# EAGLE design ElectronBoardMKI (EAGLE 9.1.3)
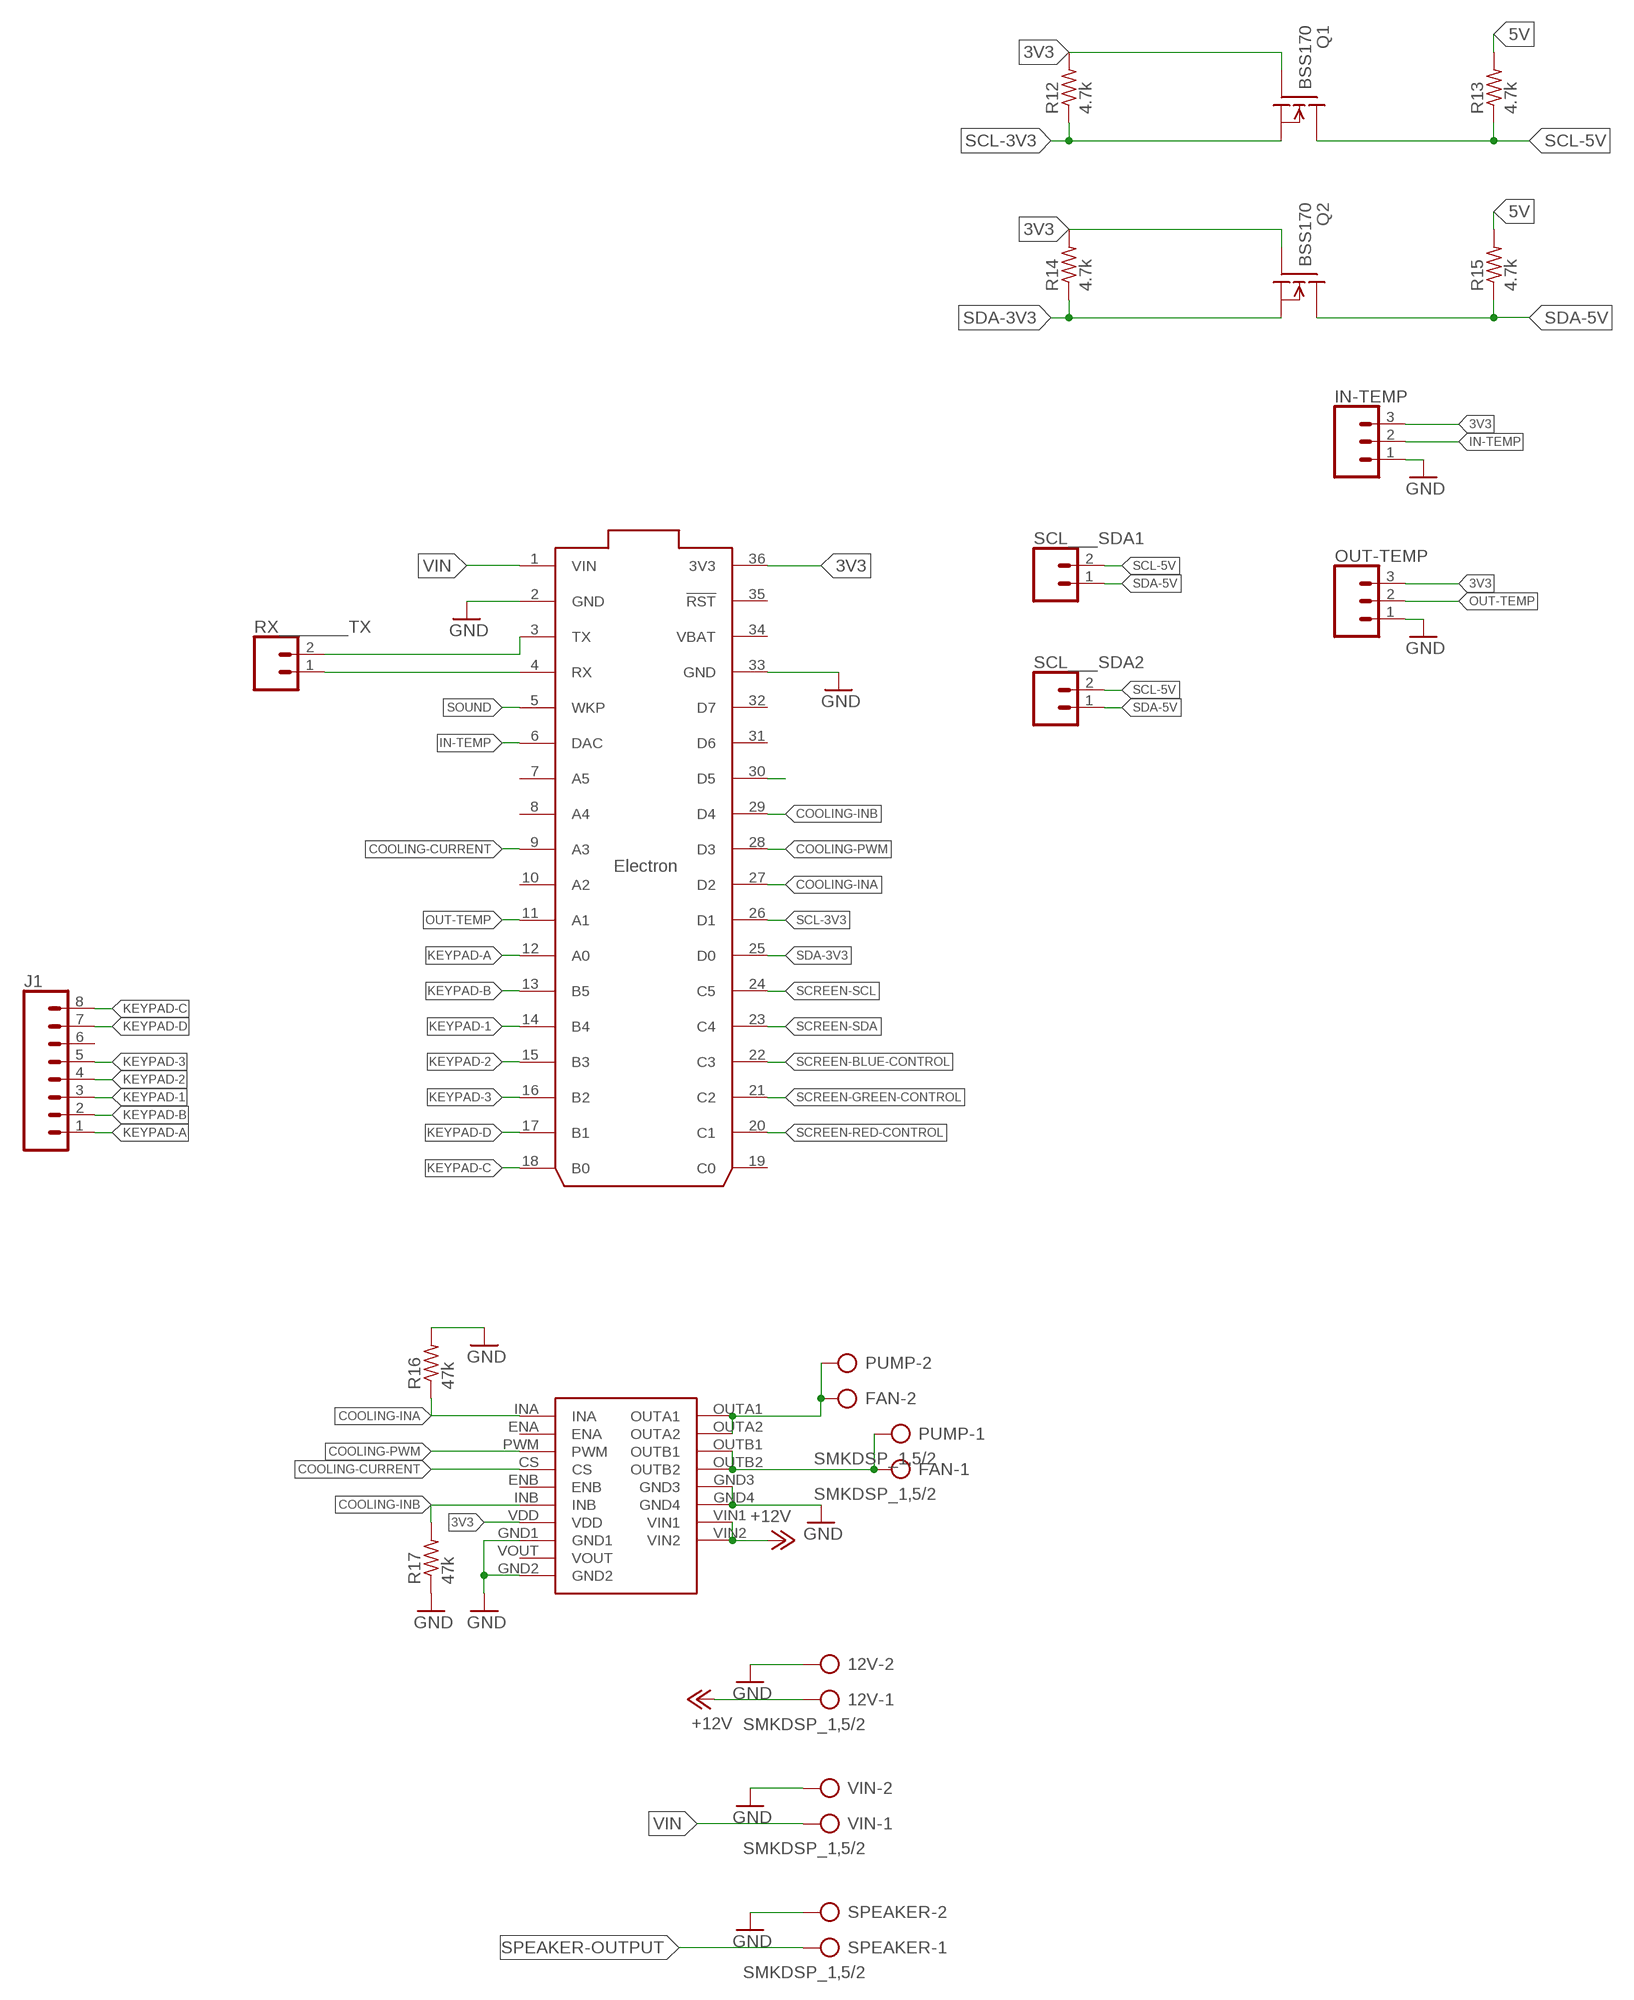
[diagram p0: schematic, sheet 1, part 1 of 2]
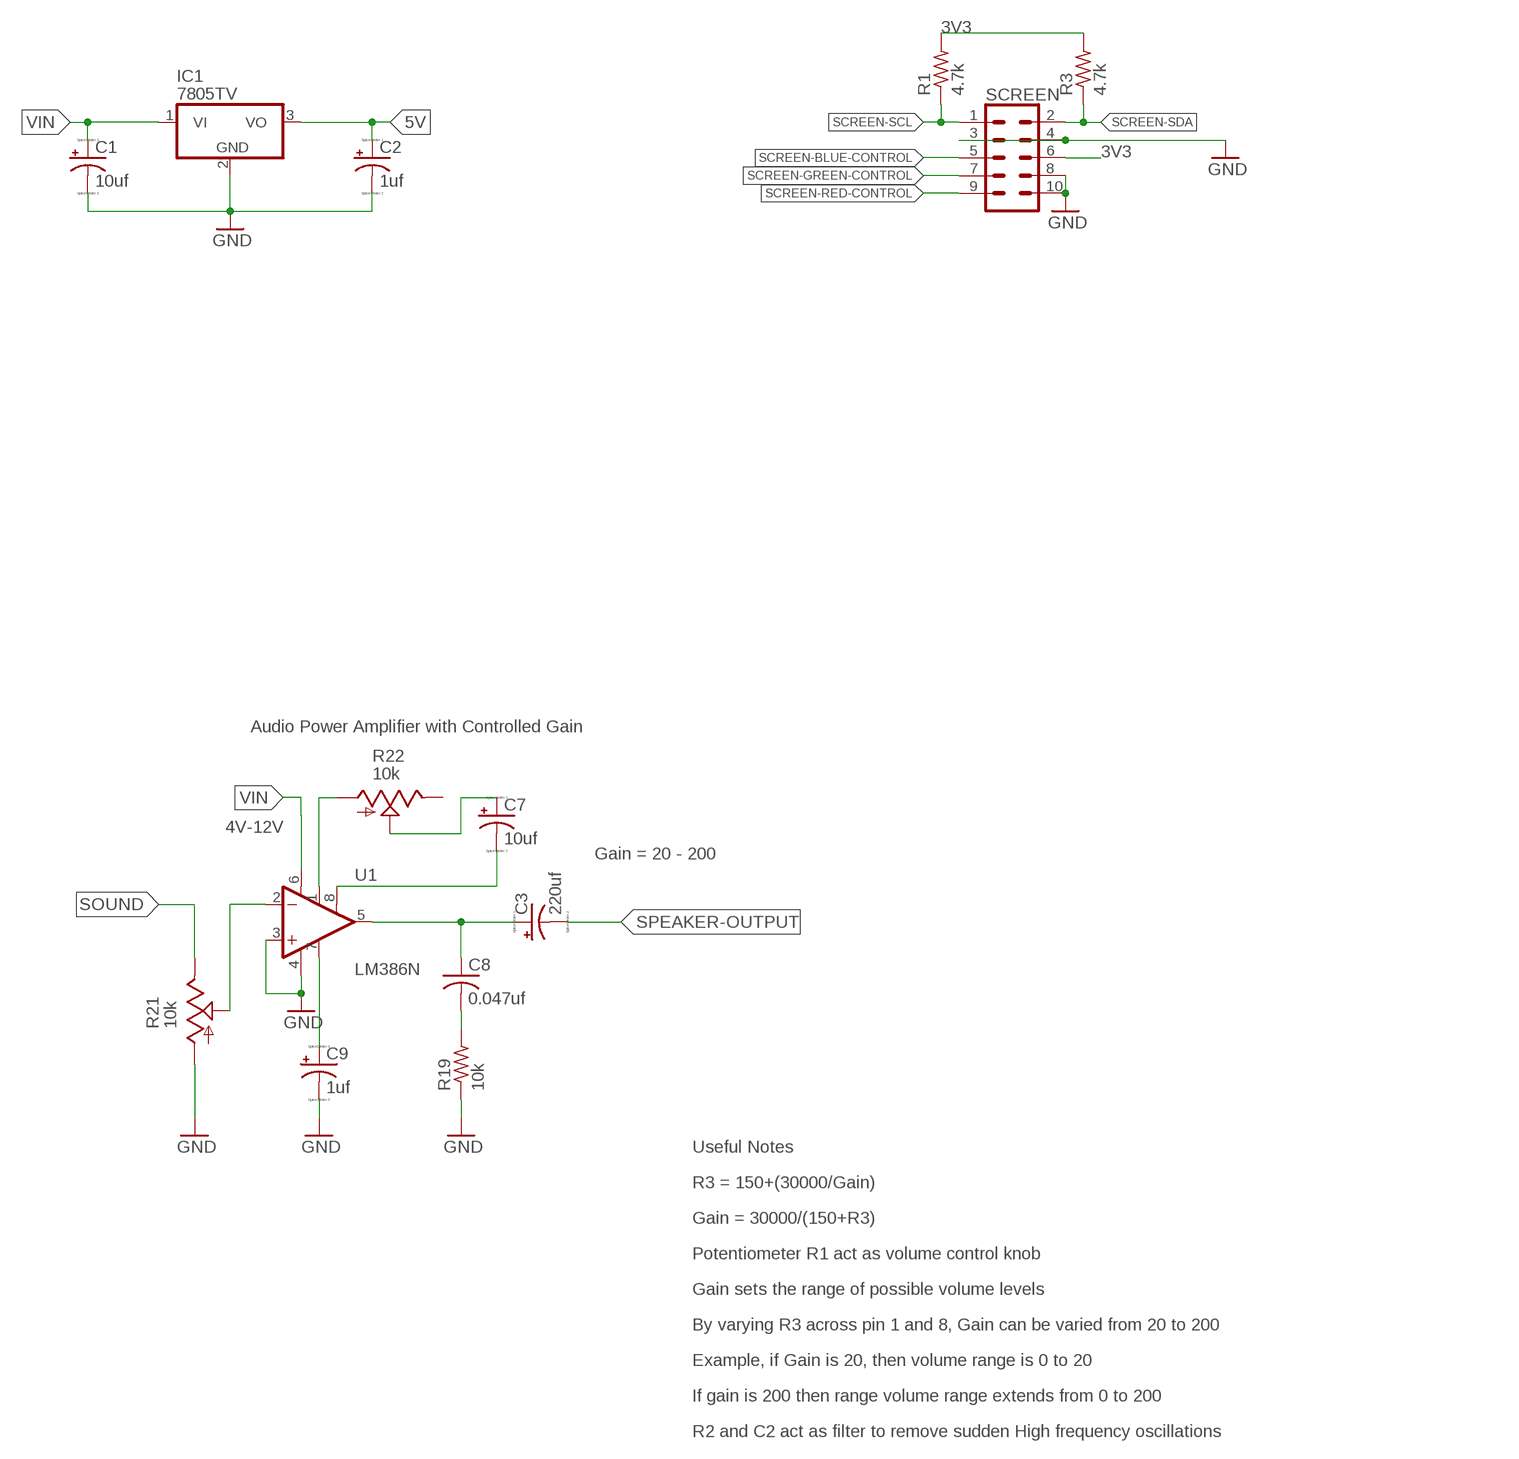
[diagram p1: schematic, sheet 1, part 2 of 2]

## Parts
12V  SMKDSP_1,5/2  [SMKDSP_1,5/2]
C1  10uf  CPOL-USE5-8.5  [E5-8,5]
C2  1uf  CPOL-USE5-8.5  [E5-8,5]
C3  220uf  CPOL-USE5-8.5  [E5-8,5]
C7  10uf  CPOL-USE5-8.5  [E5-8,5]
C8  0.047uf  C-US050-035X075  [C050-035X075]
C9  1uf  CPOL-USE5-8.5  [E5-8,5]
FAN  SMKDSP_1,5/2  [SMKDSP_1,5/2]
IC1  7805TV  [TO220V]
IN-TEMP  CONN_03LOCK_LONGPADS  [1X03_LOCK_LONGPADS]
J1  CONN_08LOCK_LONGPADS  [1X08_LOCK_LONGPADS]
OUT-TEMP  CONN_03LOCK_LONGPADS  [1X03_LOCK_LONGPADS]
PUMP  SMKDSP_1,5/2  [SMKDSP_1,5/2]
Q1  BSS170  BSS101  [TO92]
Q2  BSS170  BSS101  [TO92]
R1  4.7k  R-US_0207/12  [0207/12]
R3  4.7k  R-US_0207/12  [0207/12]
R12  4.7k  R-US_0207/12  [0207/12]
R13  4.7k  R-US_0207/12  [0207/12]
R14  4.7k  R-US_0207/12  [0207/12]
R15  4.7k  R-US_0207/12  [0207/12]
R16  47k  R-US_0207/12  [0207/12]
R17  47k  R-US_0207/12  [0207/12]
R19  10k  R-US_0207/12  [0207/12]
R21  10k  TRIM_US-CT6  [CT6]
R22  10k  TRIM_US-CT6  [CT6]
RX_______TX  CONN_02LOCK_LONGPADS  [1X02_LOCK_LONGPADS]
SCL___SDA1  CONN_02LOCK_LONGPADS  [1X02_LOCK_LONGPADS]
SCL___SDA2  CONN_02LOCK_LONGPADS  [1X02_LOCK_LONGPADS]
SCREEN  CONN_05X2SHD  [2X5-SHROUDED]
SPEAKER  SMKDSP_1,5/2  [SMKDSP_1,5/2]
U1  LM386N  LM386  [DIP08]
U$1  ELECTRON_WITH_HEADERS  [ELECTRON]
U$2  VNH5019VNH5019BOARD  [DIP3302W60P254L2400H500Q20B]
VIN  SMKDSP_1,5/2  [SMKDSP_1,5/2]

## Nets
3V3: IN-TEMP.3 OUT-TEMP.3 Q1.2(G) Q2.2(G) R1.2 R3.2 R12.2 R14.2 SCREEN.6 U$1.36(3V3) U$2.VDD
5V: C2.+ IC1.3(VO) R13.2 R15.2
+12V: 12V.1 U$2.VIN1 U$2.VIN2
COOLING-CURRENT: U$1.9(A3) U$2.CS
COOLING-INA: R16.1 U$1.27(D2) U$2.INA
COOLING-INB: R17.2 U$1.29(D4) U$2.INB
COOLING-OUTA: FAN.2 PUMP.2 U$2.OUTA1 U$2.OUTA2
COOLING-OUTB: FAN.1 PUMP.1 U$2.OUTB1 U$2.OUTB2
COOLING-PWM: U$1.28(D3) U$2.PWM
GND: 12V.2 C1.- C2.- C9.- IC1.2(GND) IN-TEMP.1 OUT-TEMP.1 R16.2 R17.1 R19.1 R21.A SCREEN.3 SCREEN.4 SCREEN.8 SCREEN.10 SPEAKER.2 U1.3(+IN) U1.4(V-) U$1.2(GND) U$1.33(GND) U$2.GND1 U$2.GND2 U$2.GND3 U$2.GND4 VIN.2
IN-TEMP: IN-TEMP.2 U$1.6(DAC)
KEYPAD-1: J1.3 U$1.14(B4)
KEYPAD-2: J1.4 U$1.15(B3)
KEYPAD-3: J1.5 U$1.16(B2)
KEYPAD-A: J1.1 U$1.12(A0)
KEYPAD-B: J1.2 U$1.13(B5)
KEYPAD-C: J1.8 U$1.18(B0)
KEYPAD-D: J1.7 U$1.17(B1)
N$1: R21.S U1.2(-IN)
N$2: C9.+ U1.7(BP)
N$4: R22.A U1.1(GAIN)
N$5: C7.- U1.8(GAIN)
N$6: C3.+ C8.1 U1.5(OUT)
N$7: C8.2 R19.2
N$8: U$1.30(D5)
N$9: C7.+ R22.S
OUT-TEMP: OUT-TEMP.2 U$1.11(A1)
RX: RX_______TX.1 U$1.4(RX)
SCL-3V3: Q1.1(S) R12.1 U$1.26(D1)
SCL-5V: Q1.3(D) R13.1 SCL___SDA1.2 SCL___SDA2.2
SCREEN-BLUE-CONTROL: SCREEN.5 U$1.22(C3)
SCREEN-GREEN-CONTROL: SCREEN.7 U$1.21(C2)
SCREEN-RED-CONTROL: SCREEN.9 U$1.20(C1)
SCREEN-SCL: R1.1 SCREEN.1 U$1.24(C5)
SCREEN-SDA: R3.1 SCREEN.2 U$1.23(C4)
SDA-3V3: Q2.1(S) R14.1 U$1.25(D0)
SDA-5V: Q2.3(D) R15.1 SCL___SDA1.1 SCL___SDA2.1
SOUND: R21.E U$1.5(WKP)
SPEAKER-OUTPUT: C3.- SPEAKER.1
TX: RX_______TX.2 U$1.3(TX)
VIN: C1.+ IC1.1(VI) U1.6(V+) U$1.1(VIN) VIN.1
Unconnected: J1.6 R22.E U$1.7(A5) U$1.8(A4) U$1.10(A2) U$1.19(C0) U$1.31(D6) U$1.32(D7) U$1.35(!RST) U$2.ENA U$2.ENB U$2.VOUT

## Notes on the sheet
- Audio Power Amplifier with Controlled Gain
- 4V-12V
- Gain = 20 - 200
- Useful Notes
- R3 = 150+(30000/Gain)
- Gain = 30000/(150+R3)
- Potentiometer R1 act as volume control knob
- Gain sets the range of possible volume levels
- By varying R3 across pin 1 and 8, Gain can be varied from 20 to 200
- Example, if Gain is 20, then volume range is 0 to 20
- If gain is 200 then range volume range extends from 0 to 200
- R2 and C2 act as filter to remove sudden High frequency oscillations

## Power pins joined to a net without a drawn wire
VBAT: U$1.34(VBAT)

## Library data of the parts
12V FAN PUMP SPEAKER VIN = con-phoenix-smkdsp:SMKDSP_1,5/2: Printklemme, Nennstrom: 17,5 A, Bemessungsspannung: 250 V, Raster: 5,0 mm Source: http://eshop.phoenixcontact.de .. 1733415.pdf; MF: FARNELL; MPN: 1733570; OC_FARNELL: 3041244; OC_NEWARK: 69C8588
C1-C3 C7 C9 = resistor:CPOL-US: POLARIZED CAPACITOR, American symbol
C8 = resistor:C-US: CAPACITOR, American symbol
IC1 = linear:78*: Positive VOLTAGE REGULATOR Source: http://cache.national.com/ds/LM/LM78L05.pdf http://www.fairchildsemi.com/ds/LM/LM7805.pdf
IN-TEMP OUT-TEMP = SparkFun-Connectors:CONN_03: Multi connection point. Often used as Generic Header-pin footprint for 0.1 inch spaced/style header connections On any of the 0.1 inch spaced packages, you can populate with these: Break Away Headers - Straight <https://www.sparkfun.com/products/116> (PRT-00116) Break Away Male Headers - Right Angle <https://www.sparkfun.com/products/553> (PRT-00553) Female Headers <https://www.sparkfun.com/products/115> (PRT-00115) Break Away Headers - Machine Pin <https://www.sparkfun.com/products/117> (PRT-00117) Break Away Female Headers - Swiss Machine Pin <https://www.sparkfun.com/products/743> (PRT-00743) Stackable Header - 3 Pin (Female, 0.1") <https://www.sparkfun.com/products/13875> (PRT-13875) For SCREWTERMINALS and SPRING TERMINALS visit here: Screw Terimnals on SparkFun.com <https://www.sparkfun.com/search/results?term=Screw+Terminals> (5mm/3.5mm/2.54mm spacing) This device is also useful as a general connection point to wire up your design to another part of your project. Our various solder wires solder well into these plated through hole pads. Hook-Up Wire - Assortment (Stranded, 22 AWG) <https://www.sparkfun.com/products/11375> (PRT-11375) Hook-Up Wire - Assortment (Solid Core, 22 AWG) <https://www.sparkfun.com/products/11367> (PRT-11367) View the entire wire category on our website here <https://www.sparkfun.com/categories/141> Special notes: Molex polarized connector foot print use with SKU : PRT-08232 with associated crimp pins and housings.
J1 = SparkFun-Connectors:CONN_08: Multi connection point. Often used as Generic Header-pin footprint for 0.1 inch spaced/style header connections On any of the 0.1 inch spaced packages, you can populate with these: Break Away Headers - Straight <https://www.sparkfun.com/products/116> (PRT-00116) Break Away Male Headers - Right Angle <https://www.sparkfun.com/products/553> (PRT-00553) Female Headers <https://www.sparkfun.com/products/115> (PRT-00115) Break Away Headers - Machine Pin <https://www.sparkfun.com/products/117> (PRT-00117) Break Away Female Headers - Swiss Machine Pin <https://www.sparkfun.com/products/743> (PRT-00743) Arduino Stackable Header - 8 Pin <https://www.sparkfun.com/products/9279> (PRT-09279) For SCREWTERMINALS and SPRING TERMINALS visit here: Screw Terimnals on SparkFun.com <https://www.sparkfun.com/search/results?term=Screw+Terminals> (5mm/3.5mm/2.54mm spacing) This device is also useful as a general connection point to wire up your design to another part of your project. Our various solder wires solder well into these plated through hole pads. Hook-Up Wire - Assortment (Stranded, 22 AWG) <https://www.sparkfun.com/products/11375> (PRT-11375) Hook-Up Wire - Assortment (Solid Core, 22 AWG) <https://www.sparkfun.com/products/11367> (PRT-11367) View the entire wire category on our website here <https://www.sparkfun.com/categories/141> Special notes: Molex polarized connector foot print use with SKU : PRT-08231 with associated crimp pins and housings. 1MM SMD Version SKU: PRT-10208 NOTES ON THE VARIANTS LOCK and LOCK_LONGPADS... This footprint was designed to help hold the alignment of a through-hole component (i.e. 6-pin header) while soldering it into place. You may notice that each hole has been shifted either up or down by 0.005 of an inch from it's more standard position (which is a perfectly straight line). This slight alteration caused the pins (the squares in the middle) to touch the edges of the holes. Because they are alternating, it causes a "brace" to hold the component in place. 0.005 has proven to be the perfect amount of "off-center" position when using our standard breakaway headers. Although looks a little odd when you look at the bare footprint, once you have a header in there, the alteration is very hard to notice. Also,if you push a header all the way into place, it is covered up entirely on the bottom side.
Q1 Q2 = transistor-fet:BSS101: N-Channel Enhancement MOSFET 200V; 0,16A; 11Ohm
R1 R3 R12-R17 R19 = resistor:R-US_: RESISTOR, American symbol
R21 R22 = pot:TRIM_US-: POTENTIOMETER
RX_______TX SCL___SDA1 SCL___SDA2 = SparkFun-Connectors:CONN_02: Multi connection point. Often used as Generic Header-pin footprint for 0.1 inch spaced/style header connections On any of the 0.1 inch spaced packages, you can populate with these: Break Away Headers - Straight <https://www.sparkfun.com/products/116> (PRT-00116) Break Away Male Headers - Right Angle <https://www.sparkfun.com/products/553> (PRT-00553) Female Headers <https://www.sparkfun.com/products/115> (PRT-00115) Break Away Headers - Machine Pin <https://www.sparkfun.com/products/117> (PRT-00117) Break Away Female Headers - Swiss Machine Pin <https://www.sparkfun.com/products/743> (PRT-00743) For SCREWTERMINALS and SPRING TERMINALS visit here: Screw Terimnals on SparkFun.com <https://www.sparkfun.com/search/results?term=Screw+Terminals> (5mm/3.5mm/2.54mm spacing) This device is also useful as a general connection point to wire up your design to another part of your project. Our various solder wires solder well into these plated through hole pads. Hook-Up Wire - Assortment (Stranded, 22 AWG) <https://www.sparkfun.com/products/11375> (PRT-11375) Hook-Up Wire - Assortment (Solid Core, 22 AWG) <https://www.sparkfun.com/products/11367> (PRT-11367) View the entire wire category on our website here <https://www.sparkfun.com/categories/141> Special notes: Molex polarized connector foot print use with: PRT-08233 with associated crimp pins and housings. 2.54_SCREWTERM for use with PRT-10571. 3.5mm Screw Terminal footprints for PRT-08084 5mm Screw Terminal footprints for use with PRT-08432
SCREEN = SparkFun-Connectors:CONN_05X2: Multi connection point. Often used as Generic Header-pin footprint for 0.1 inch spaced/style header connections For AVR SPI programming port, see special device with nice symbol: "AVR_SPI_PROG_5x2.dev" You can populate with any combo of single row headers, but if you'd like an exact match, check these: 2x5 AVR ICSP Male Header <https://www.sparkfun.com/products/778> (PRT-00778) 2x5 Pin Shrouded Header <https://www.sparkfun.com/products/8506> (PRT-08506) On any of the 0.1 inch spaced packages, you can populate with these: Break Away Headers - Straight <https://www.sparkfun.com/products/116> (PRT-00116) Break Away Male Headers - Right Angle <https://www.sparkfun.com/products/553> (PRT-00553) Female Headers <https://www.sparkfun.com/products/115> (PRT-00115) Break Away Headers - Machine Pin <https://www.sparkfun.com/products/117> (PRT-00117) Break Away Female Headers - Swiss Machine Pin <https://www.sparkfun.com/products/743> (PRT-00743) Special note: the shrouded connector mates well with our 5x2 ribbon cables: 2x5 Pin IDC Ribbon Cable <https://www.sparkfun.com/products/8535> (PRT-08535); PROD_ID: CONN-08671; SF_ID: PRT-08506
U1 = SparkFun-IC-Amplifiers:LM386: low voltage audio power amplifier SparkFun Products FabFM Radio Kit <https://www.sparkfun.com/products/11043> (KIT-11043); PROD_ID: IC-10899
U$1 = Particle-Devices:ELECTRON: The Particle Electron is a tiny development kit for creating cellular-connected electronics projects and products. It comes with a SIM card (Nano 4FF) and an affordable data plan for low-bandwidth things. Design files : here <https://github.com/particle-iot/electron> Product Page : Datasheet <https://docs.particle.io/datasheets/electron-(cellular)/electron-datasheet/> Github : Particle devices library <https://github.com/particle-iot/hardware-libraries/tree/master/Eagle>
U$2 = GEMS:VNH5019

## Board
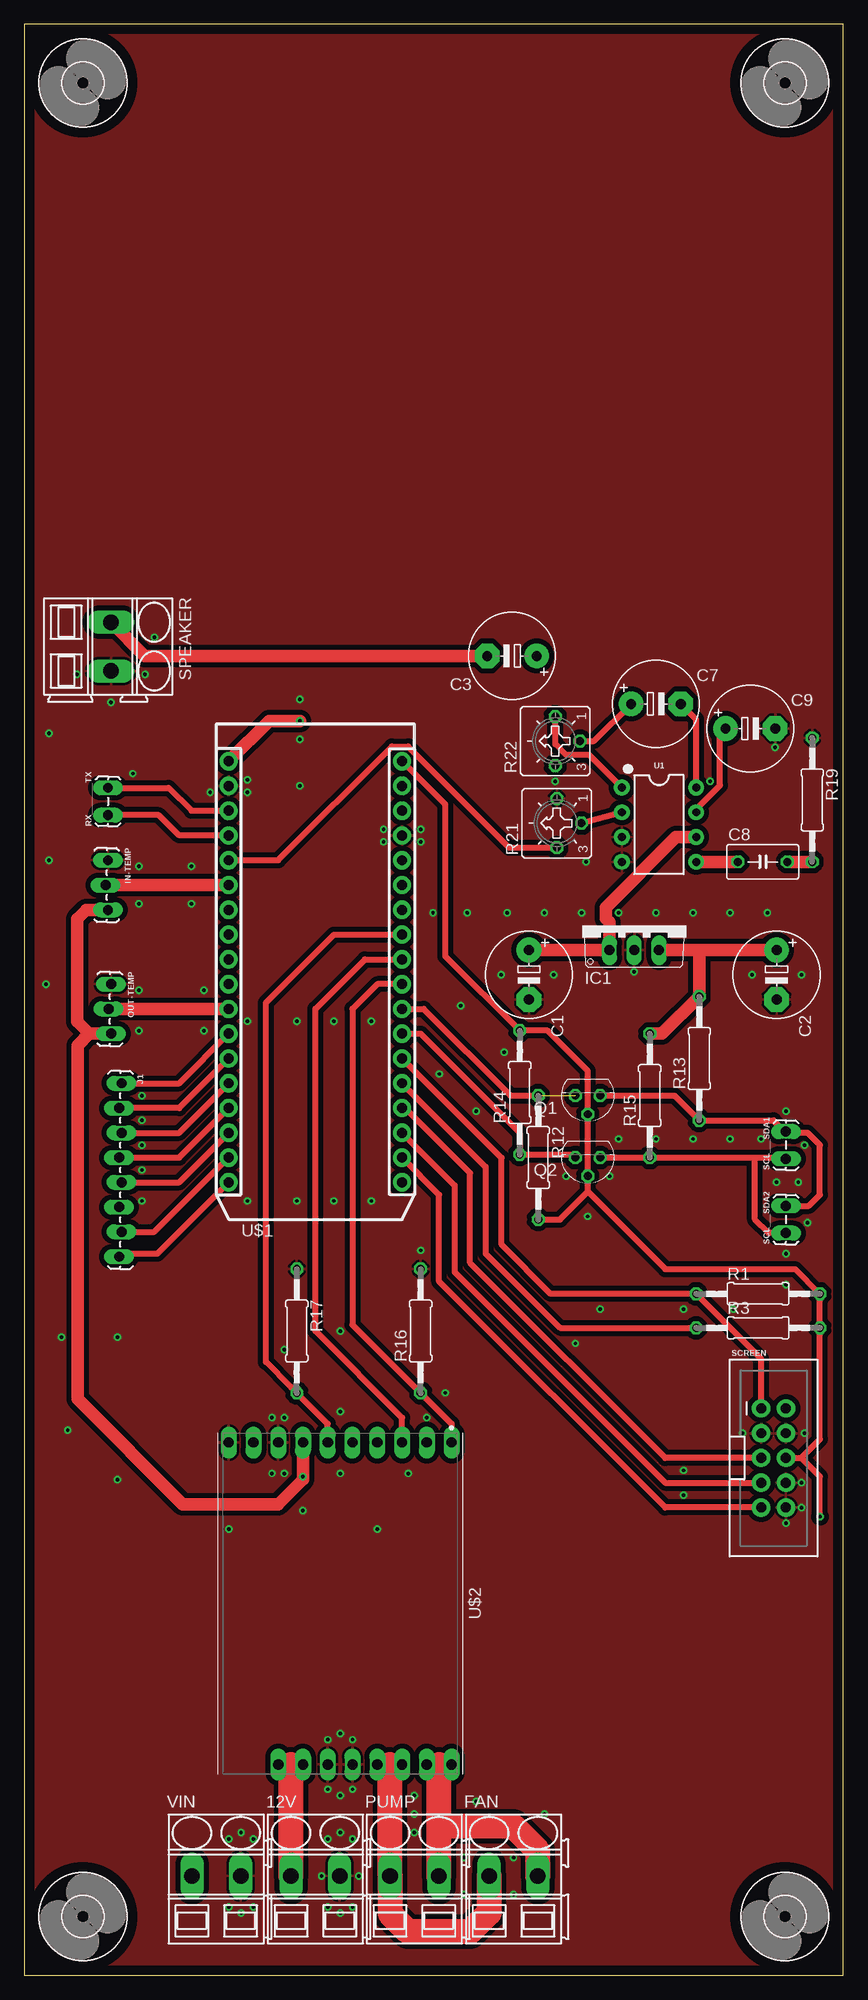
[diagram p2: board, top side]
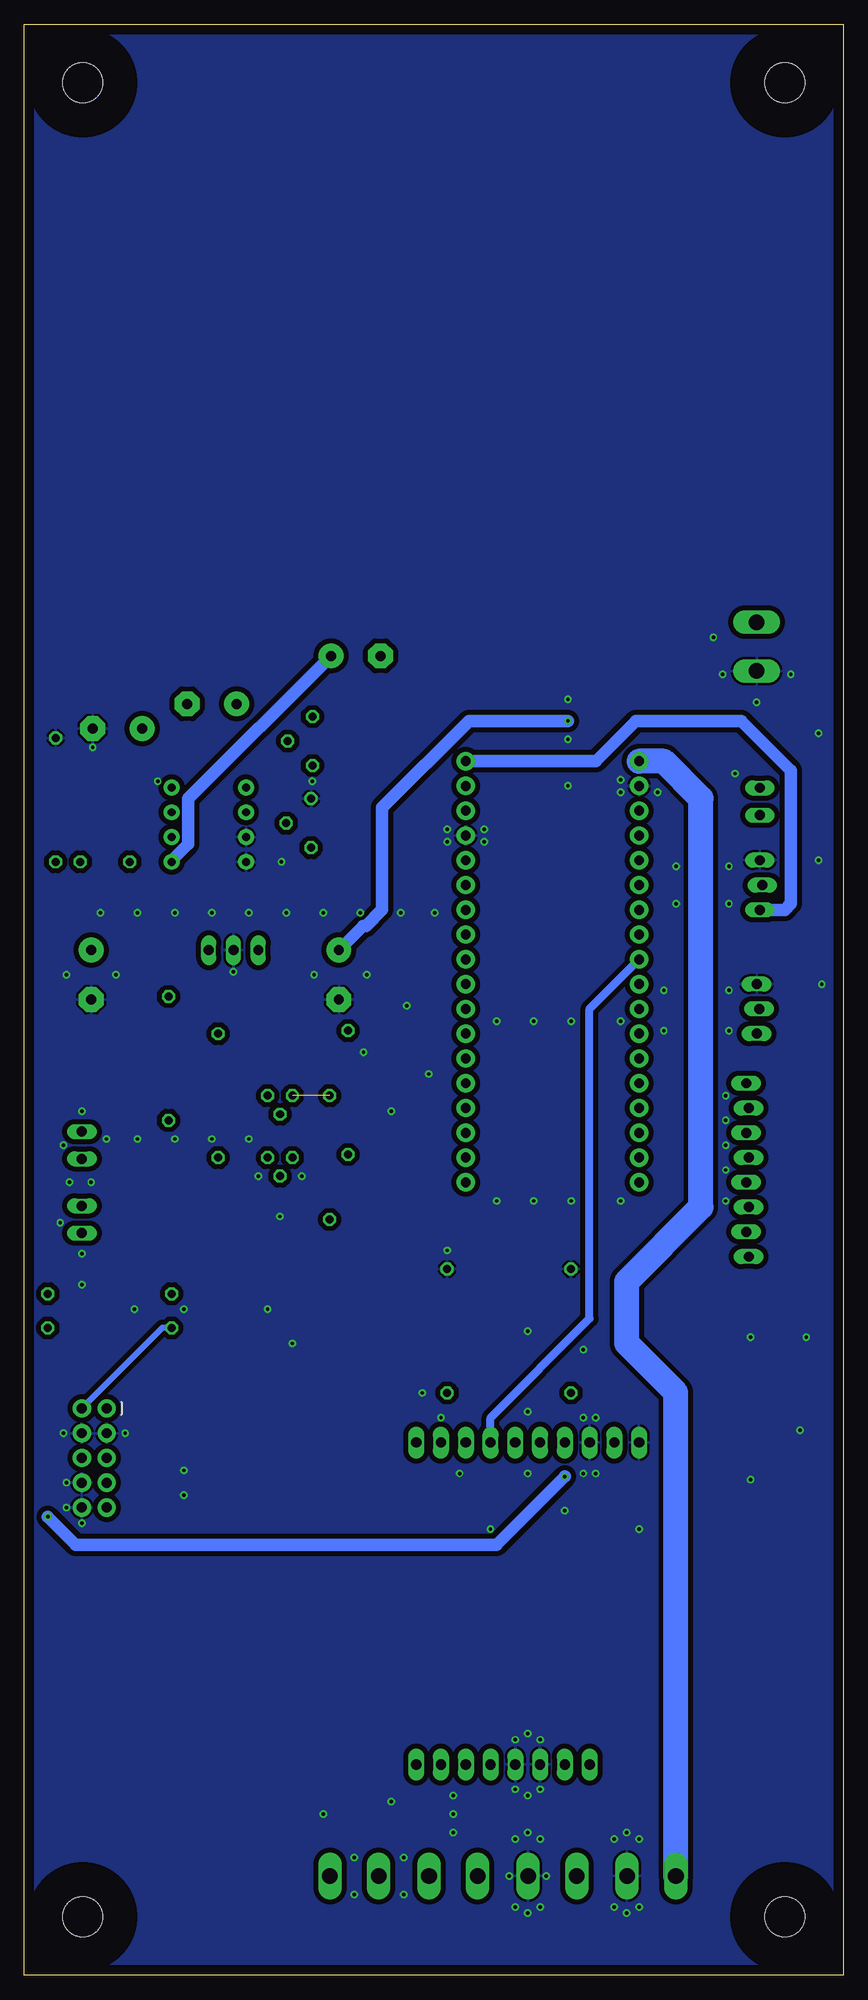
[diagram p3: board, bottom side, seen from below]

Size 84 x 200 mm. Coordinates in mm from the lower left corner, seen from the top.
Outline: 0,0 84,0 84,200 0,200 0,0
Copper layers (1*16): Top 0.035mm / dielectric 1.5mm / Bottom 0.035mm
Design rules "default *": minimum track width 6mil, minimum drill 0.35mm, track to track 20mil, track to pad 10mil, pad to pad 6mil, via to via 6mil, smd to smd 6mil, copper to edge 40mil, drill to drill 6mil, minimum pad ring 10mil, minimum via ring 8mil, stop-mask expansion 4mil, vias tented up to drill 0mil, thermal gap 10mil

### Footprints (pad centres in the part's own frame; a part is rotated, then mirrored left to right if it is on the bottom)
SMKDSP_1,5/2 = drill 1.6 pad 1.8 long: 1 -2.5,0; 2 2.5,0
E5-8,5 = drill 1.016 pad 2.54: + -2.54,0 | drill 1.016 pad 2.54 octagon: - 2.54,0
C050-035X075 = drill 0.813 octagon: 1 -2.54,0; 2 2.54,0
TO220V = drill 1.016 long: 1 -2.54,-2.54; 2 0,-2.54; 3 2.54,-2.54
1X03_LOCK_LONGPADS = drill 1.016 long: 1 0,0; 2 2.54,-0.254; 3 5.08,0
1X08_LOCK_LONGPADS = drill 1.016 long: 1 0,0.127; 2 2.54,-0.127; 3 5.08,0.127; 4 7.62,-0.127; 5 10.16,0.127; 6 12.7,-0.127; 7 15.24,0.127; 8 17.78,-0.127
TO92 = drill 0.813 octagon: 1 1.27,0; 2 0,1.905; 3 -1.27,0
0207/12 = drill 0.813 octagon: 1 -6.35,0; 2 6.35,0
CT6 = drill 0.813 octagon: A 2.515,0; E -2.515,0; S 0,-2.54
1X02_LOCK_LONGPADS = drill 1.016 long: 1 -0.127,0; 2 2.667,0
2X5-SHROUDED = drill 1.016 pad 1.88: 1 -1.27,5.08; 2 1.27,5.08; 3 -1.27,2.54; 4 1.27,2.54; 5 -1.27,0; 6 1.27,0; 7 -1.27,-2.54; 8 1.27,-2.54; 9 -1.27,-5.08; 10 1.27,-5.08
DIP08 = drill 0.813 pad 1.626: 1 -3.81,-3.81; 2 -1.27,-3.81; 3 1.27,-3.81; 4 3.81,-3.81; 5 3.81,3.81; 6 1.27,3.81; 7 -1.27,3.81; 8 -3.81,3.81
ELECTRON = drill 1.016 pad 1.88: 1 1.27,46.99; 2 1.27,44.45; 3 1.27,41.91; 4 1.27,39.37; 5 1.27,36.83; 6 1.27,34.29; 7 1.27,31.75; 8 1.27,29.21; 9 1.27,26.67; 10 1.27,24.13; 11 1.27,21.59; 12 1.27,19.05; 13 1.27,16.51; 14 1.27,13.97; 15 1.27,11.43; 16 1.27,8.89; 17 1.27,6.35; 18 1.27,3.81; 19 19.05,3.81; 20 19.05,6.35; 21 19.05,8.89; 22 19.05,11.43; 23 19.05,13.97; 24 19.05,16.51; 25 19.05,19.05; 26 19.05,21.59; 27 19.05,24.13; 28 19.05,26.67; 29 19.05,29.21; 30 19.05,31.75; 31 19.05,34.29; 32 19.05,36.83; 33 19.05,39.37; 34 19.05,41.91; 35 19.05,44.45; 36 19.05,46.99
DIP3302W60P254L2400H500Q20B = drill 1.048 pad 1.649 long: CS -16.51,3.81; ENA -16.51,8.89; ENB -16.51,1.27; GND1 -16.51,-6.35; GND2 -16.51,-11.43; GND3 16.51,1.27; GND4 16.51,-1.27; INA -16.51,11.43; INB -16.51,-1.27; OUTA1 16.51,11.43; OUTA2 16.51,8.89; OUTB1 16.51,6.35; OUTB2 16.51,3.81; PWM -16.51,6.35; VDD -16.51,-3.81; VIN1 16.51,-3.81; VIN2 16.51,-6.35; VOUT -16.51,-8.89
4,1 = hole 4.1: 0,0

### Placement (x,y rotation side)
12V  29.84,10.16 0 top
C1  51.75,102.55 270 top
C2  77.15,102.55 270 top
C3  50.01,135.25 180 top
C7  64.77,130.33 0 top
C8  75.72,114.14 0 top
C9  74.45,127.79 0 top
FAN  50.16,10.16 0 top
IC1  62.55,107.63 0 top
IN-TEMP  8.57,114.3 270 top
J1  9.84,91.44 270 top
OUT-TEMP  8.89,101.6 270 top
PUMP  40.01,10.16 0 top
Q1  57.78,90.17 180 top
Q2  57.78,83.82 180 top
R1  75.25,69.85 0 top
R3  75.25,66.36 0 top
R12  52.7,83.82 270 top
R13  69.22,93.98 90 top
R14  50.8,90.49 90 top
R15  64.14,90.17 90 top
R16  40.64,66.04 90 top
R17  27.94,66.04 270 top
R19  80.8,120.49 270 top
R21  54.61,118.11 90 top
R22  54.45,126.52 90 top
RX_______TX  8.57,119.06 90 top
SCL___SDA1  78.11,83.82 90 top
SCL___SDA2  78.11,76.2 90 top
SCREEN  76.83,53.02 0 top
SPEAKER  8.89,136.21 270 top
U1  65.09,117.95 270 top
U$1  19.68,77.47 0 top
U$2  32.38,38.1 270 top
U$3  [4,1]  6,194 0 top
U$4  [4,1]  78,194 0 top
U$5  [4,1]  6,6 0 top
U$6  [4,1]  78,6 0 top
VIN  19.68,10.16 0 top

### Tracks (layer width: path | path; a pad name or v marks a point on that pad's centre or on a via)
3V3  (via drill 0.35)
  Top 0.61: v81.6,46.99 81.6,51.12 79.69,53.02 | R14.2 43.18,104.46 43.18,120.02 U$1.36
  Top 0.635: R14.2 53.66,96.84 57.78,92.71 Q1.2 Q2.2 57.78,80.33 | SCREEN.6 79.69,53.02 81.6,54.93 R3.2 R1.2 79.06,72.39 65.72,72.39 57.78,80.33 | R12.2 54.93,77.47 57.78,80.33
  Top 1.27: IN-TEMP.3 6.35,109.22 5.4,108.27 5.4,97.79 6.67,96.52 | 6.67,96.52 5.46,95.31 5.46,59.05 16.26,48.26 26.04,48.26 28.57,50.8 v28.57,51.12 U$2.VDD | OUT-TEMP.3 6.67,96.52
  Bottom 1.27: IN-TEMP.3 6.03,109.22 5.4,109.86 5.4,123.51 10.48,128.59 21.27,128.59 25.4,124.46 U$1.36 | v28.57,51.12 35.56,44.13 78.74,44.13 v81.6,46.99
5V
  Top 1.27: R15.2 65.41,96.52 R13.2 69.22,105.09 IC1.3 C2.+
+12V
  Top 1.27: U$2.VIN1 27.3,21.59 U$2.VIN2
  Top 2.54: 12V.1 27.34,21.55 27.3,21.59
COOLING-CURRENT
  Bottom 0.813: U$2.CS 36.2,57.15 26.04,67.31 26.04,99.06 U$1.9
COOLING-INA
  Top 0.635: U$1.27 36.2,101.6 33.66,99.06 33.66,66.67 40.01,60.33 R16.1 43.81,56.52 U$2.INA
COOLING-INB
  Top 0.152: R17.2 27.3,60.33
  Top 0.635: U$1.29 31.75,106.68 24.77,99.69 24.77,62.87 27.3,60.33 31.11,56.52 U$2.INB
COOLING-OUTA
  Top 1.27: U$2.OUTA1 42.55,21.59 U$2.OUTA2
  Top 2.54: PUMP.2 42.51,15.24 | 42.51,15.24 42.51,21.55 42.55,21.59 | FAN.2 52.66,12.74 50.16,15.24 42.51,15.24
COOLING-OUTB
  Top 1.27: U$2.OUTB1 37.47,21.59 U$2.OUTB2
  Top 2.54: 37.47,21.59 37.51,21.55 PUMP.1 37.51,6.31 39.37,4.45 45.72,4.45 47.66,6.39 FAN.1
COOLING-PWM
  Top 0.635: U$1.28 34.92,104.14 29.84,99.06 29.84,66.04 38.73,57.15 38.73,55.88 U$2.PWM
GND  (via drill 0.35)
  other vias: 22.86,79.38 25.4,57.15 26.67,51.44 26.67,57.15 25.4,51.44 20.95,13.97 23.5,13.97 20.95,6.99 23.5,6.99 22.23,6.35 22.23,14.61 31.11,13.97 33.66,13.97 31.11,6.99 33.66,6.99 32.38,14.61 32.38,6.35 30.48,10.16 34.29,10.16 31.11,24.13 33.66,24.13 32.38,24.77 31.11,19.05 32.38,18.41 33.66,19.05 19.05,121.28 22.86,121.28 22.86,122.56 36.83,117.47 36.83,116.2 40.64,116.2 40.64,117.47 48.9,102.55 54.29,102.55 74.61,102.55 79.69,102.55 53.34,108.9 62.55,102.87 11.11,123.19 2.54,127.32 31.75,79.38 35.56,79.38 17.14,113.67 17.14,109.86 18.41,96.84 18.41,100.97 11.75,96.84 11.75,100.97 11.75,109.86 11.75,113.67 2.54,114.3 2.22,101.6 27.94,79.38 31.75,97.79 35.56,97.79 27.94,97.79 22.86,97.79 41.91,108.9 60.96,85.72 64.77,85.72 68.58,85.72 72.39,85.72 57.15,108.9 60.96,108.9 64.77,108.9 68.58,108.9 72.39,108.9 76.2,108.9 40.01,16.51 40.01,18.41 40.01,14.61 45.09,12.06 45.09,8.26 50.16,12.06 50.16,8.26 46.35,17.78 53.34,16.51 32.38,57.78 26.67,64.14 39.37,51.44 41.27,57.15 32.38,66.04 32.38,51.44 28.57,47.62 20.95,45.72 36.2,45.72 45.4,108.9 75.56,85.72 78.11,73.98 80.33,77.15 78.11,88.58 80.01,85.09 77.15,81.28 79.38,81.28 3.81,65.41 9.53,65.41 49.53,108.9 9.53,50.8 4.45,55.88 8.89,130.49 12.06,90.17 12.06,87.63 12.06,85.09 12.06,82.55 12.06,79.38 43.18,59.69 40.64,74.3 57.63,114.14 54.45,122.4 76.99,125.89 70.33,122.4 42.55,92.39 46.35,88.58 59.05,68.26 80.01,55.56 73.66,55.56 79.69,50.48 79.69,47.94 78.11,46.35 56.52,64.77 67.63,51.75 67.63,49.21 55.56,81.92 60.01,81.92 57.78,77.79 72.71,68.26 78.11,70.8 67.63,68.26 28.26,126.68 28.26,121.92 28.26,130.81 12.38,133.35 5.4,133.35 13.34,137.16 44.77,99.38 49.21,94.61
  pour Bottom (isolate 0.508): -19.05,226.06 -19.05,-26.67 110.49,-26.67 110.49,226.06
  pour Top (isolate 0.508): -7.62,210.82 -7.62,-13.97 97.79,-13.97 97.79,212.09 -6.35,212.09
IN-TEMP
  Top 1.27: IN-TEMP.2 U$1.6
KEYPAD-1
  Top 0.635: J1.3 15.88,86.36 U$1.14
KEYPAD-2
  Top 0.635: J1.4 15.88,83.82 U$1.15
KEYPAD-3
  Top 0.635: J1.5 15.88,81.28 U$1.16
KEYPAD-A
  Top 0.635: J1.1 15.88,91.44 U$1.12
KEYPAD-B
  Top 0.635: J1.2 15.88,88.9 U$1.13
KEYPAD-C
  Top 0.635: J1.8 10.03,73.98 13.65,73.98 U$1.18
KEYPAD-D
  Top 0.635: J1.7 13.34,76.2 U$1.17
N$1
  Top 0.635: R21.S U1.2
N$2
  Top 0.635: U1.7 68.9,119.53 71.34,121.98 71.34,127.22 C9.+
N$4
  Top 0.635: U1.1 57.94,125.09 55.56,125.09 54.45,126.21 R22.A
N$5
  Top 0.635: U1.8 68.9,128.75 C7.-
N$6
  Top 1.27: U1.5 C8.1
  Bottom 1.27: U1.5 68.9,114.28 67.2,115.98 67.2,120.61 C3.+
N$7
  Top 1.27: R19.2 C8.2
N$9
  Top 0.635: R22.S 58.42,126.52 C7.+
OUT-TEMP
  Top 1.27: OUT-TEMP.2 U$1.11
RX
  Top 0.635: U$1.4 15.88,116.84 13.78,118.94 RX_______TX.1
SCL-3V3  (1 unrouted)
  Top 0.635: R12.1 49.85,90.17 40.96,99.06 U$1.26
SCL-5V
  Top 0.635: Q1.3 66.67,90.17 R13.1 76.83,87.63 78.11,86.36 | 78.11,86.36 SCL___SDA1.2 | SCL___SDA2.2 80.45,78.87 81.6,80.01 81.6,85.09 80.33,86.36 78.11,86.36
SCREEN-BLUE-CONTROL
  Top 0.635: SCREEN.5 65.72,53.02 45.72,73.03 45.72,82.23 39.05,88.9 U$1.22
SCREEN-GREEN-CONTROL
  Top 0.635: U$1.21 44.13,80.96 44.13,72.07 65.72,50.48 SCREEN.7
SCREEN-RED-CONTROL
  Top 0.635: SCREEN.9 65.72,47.94 42.55,71.12 42.55,80.01 U$1.20
SCREEN-SCL
  Top 0.635: SCREEN.1 75.56,63.18 R1.1 53.98,69.85 48.93,74.89 48.93,83.78 U$1.24
SCREEN-SDA
  Top 0.635: U$1.23 47.31,82.87 47.31,73.98 54.93,66.36 R3.1
  Bottom 0.635: R3.1 69.85,66.36 SCREEN.2
SDA-3V3
  Top 0.635: Q2.1 56.2,84.14 R14.1 50.8,86.36 40.64,96.52 U$1.25
SDA-5V
  Top 0.635: 78.11,83.82 SCL___SDA1.1 77.98,83.82 74.93,83.82 | Q2.3 R15.1 74.93,83.82 | SCL___SDA2.1 76.33,76.07 74.93,77.47 74.93,83.82
SOUND
  Top 0.61: R21.E 49.72,115.59 39.36,125.96 37.69,125.96 26.04,114.3
  Top 0.635: U$1.5 26.04,114.3
SPEAKER-OUTPUT
  Top 1.27: C3.- 12.34,135.25 SPEAKER.1
TX
  Top 0.635: U$1.3 17.14,119.38 14.8,121.73 RX_______TX.2
VIN  (via drill 0.35)
  Top 1.27: v28.26,128.59 25.08,128.59 U$1.1 | C1.+ IC1.1 60.01,107.97 59.63,108.35 59.63,109.48 66.83,116.68 U1.6
  Bottom 1.27: v28.26,128.59 38.42,128.59 47.31,119.7 47.31,109.24 48.98,107.57 49.27,107.57 C1.+
  Bottom 2.54: VIN.1 17.18,59.73 22.23,64.77 22.23,71.12 14.61,78.74 14.61,120.65 18.41,124.46 U$1.1